# Altium project 0008-NSA_IR_Sync_Board.PrjPCB
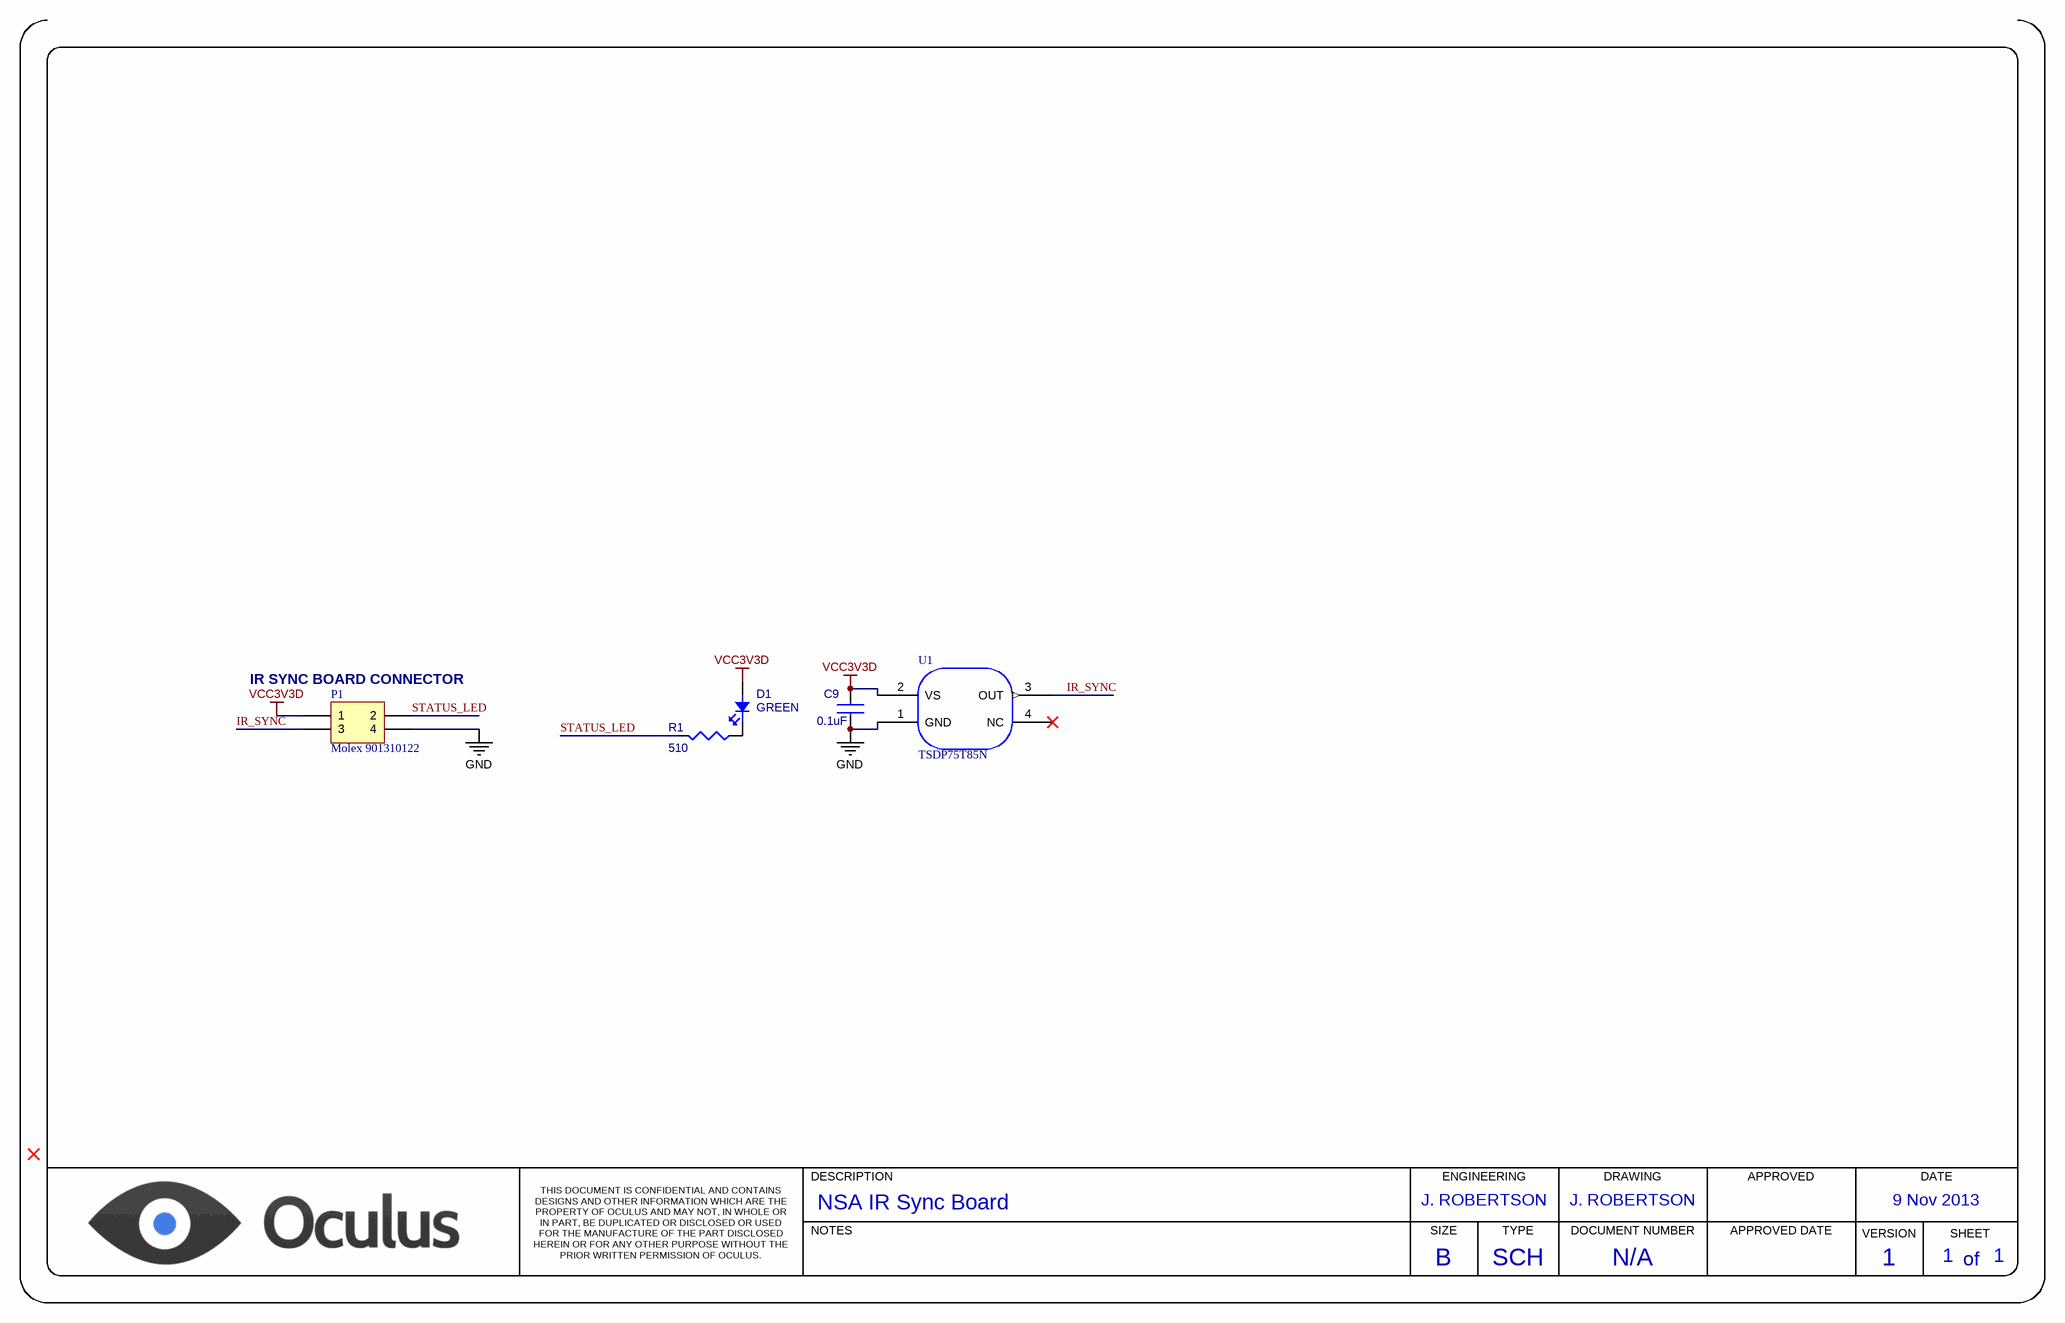
[diagram p0: 0008-NSA_IR_Sync_Board.SchDoc]
1 sheet, 5 parts. Net scope: global (net labels, ports and power ports of the same name join across sheets).
Board file: 0008-NSA_IR_Sync_Board.PcbDoc

## Sheet 0008-NSA_IR_Sync_Board.SchDoc
size B; DocumentNumber: 1; SheetNumber: 1; SheetTotal: 1; PageSetup: Record=PageOptions|CenterHorizontal=True|CenterVertical=True|PrintScale=0.70|XCorrection=1.00|YCorrection=1.00|PrintKind=1|BorderSize=5000000|LeftOffset=0|BottomOffset=0|Orientation=2|PaperLength=1000|PaperWidth=1000|Scale=100|PaperSource=15|PrintQuality=600|MediaType=1|DitherType=0|PaperKind=Letter|PrintScaleMode=1

### Parts
C9  0.1uF  [RESISTOR_0603]
D1  Color: GREEN  [LED_GREEN_0603]  (hidden comment: LED)
P1  Molex 901310122  [90131-0122]
R1  510  [RESISTOR_0603]
U1  TSDP75T85N  [TSDP75T85N]

### Nets
GND: C9.2 P1.4 U1.1(GND)
VCC3V3D: C9.1 D1.1(A) P1.1 U1.2(VS)
IR_SYNC: P1.3 U1.3(OUT)
STATUS_LED: P1.2 R1.2
NetD1_2: D1.2(K) R1.1

Not connected (* = marked no-connect by the designer): U1 4(NC)*

### Notes on the sheet
- (near P1) IR SYNC BOARD CONNECTOR
- DESCRIPTION
- ENGINEERING
- DRAWING
- APPROVED
- DATE
- NOTES
- NSA IR Sync Board
- J. ROBERTSON
- SIZE
- TYPE
- DOCUMENT NUMBER
- APPROVED DATE
- VERSION
- 9 Nov 2013
- SHEET
- of
- THIS DOCUMENT IS CONFIDENTIAL AND CONTAINS DESIGNS AND OTHER INFORMATION WHICH ARE THE PROPERTY OF OCULUS AND MAY NOT, IN WHOLE OR IN PART, BE DUPLICATED OR DISCLOSED OR USED FOR THE MANUFACTURE OF THE PART DISCLOSED HEREIN OR FOR ANY OTHER PURPOSE WITHOUT THE PRIOR WRITTEN PERMISSION OF OCULUS.
- B
- SCH
- N/A
- 1

### Library data of the parts
C9 = CAP, CERAMIC: CAP CER 0.1UF 6.3V 20% X5R 0402; Supplier 1: Digi-Key; Supplier Part Number 1: 399-8944-1-ND
D1 = LED: LED, GREEN, 0603; Supplier 1: Digi-Key; Supplier Part Number 1: 754-1116-1-ND
P1 = Header 2X2: CONN HEADER 4POS .100" STR TIN; Supplier 1: Digi-Key; Supplier Part Number 1: WM8120-ND
R1 = RESISTOR: RES 510 OHM 1/10W 1% 0603 SMD; Supplier 1: Digi-Key; Supplier Part Number 1: 311-510HRCT-ND
U1 = TSDP75T85N: IR Receiver Modules for Remote Control Systems